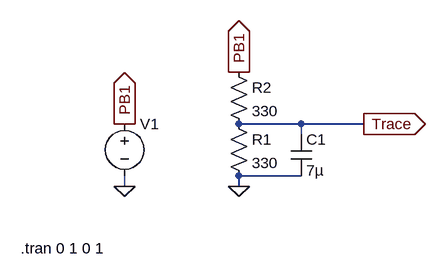
[diagram p0: schematic CircuitExample.asc]
CircuitExample.asc, the LTspice schematic file:
Version 4.1
SHEET 1 880 680
WIRE 256 144 160 144
WIRE 352 144 256 144
WIRE 256 160 256 144
WIRE 256 224 160 224
WIRE -16 240 -16 224
WIRE 160 240 160 224
FLAG 160 240 0
FLAG -16 240 0
FLAG -16 144 PB1
IOPIN -16 144 Out
FLAG 160 64 PB1
IOPIN 160 64 Out
FLAG 352 144 Trace
IOPIN 352 144 Out
SYMBOL res 144 128 R0
SYMATTR InstName R1
SYMATTR Value 330
SYMBOL res 144 48 R0
SYMATTR InstName R2
SYMATTR Value 330
SYMBOL cap 240 160 R0
SYMATTR InstName C1
SYMATTR Value 7µ
SYMBOL voltage -16 128 R0
WINDOW 3 24 96 Invisible 2
WINDOW 123 0 0 Left 0
WINDOW 39 0 0 Left 0
SYMATTR InstName V1
SYMATTR Value PULSE(0 5 0 0.00000001 0.00000001 {0.5/62500} {1/62500} 1000000)
TEXT -176 336 Left 2 !.tran 0 1 0 1

The netlist it stands for:
* CircuitExample.asc
R1 Trace 0 330
R2 PB1 Trace 330
C1 Trace 0 7µ
V1 PB1 0 PULSE(0 5 0 0.00000001 0.00000001 {0.5/62500} {1/62500} 1000000)
.tran 0 1 0 1
.backanno
.end